# Altium schematic sheet digital.SchDoc: Digital
size A4; DrawnBy: ZXR; DocumentNumber: 20251214; Revision: 1.0; SheetNumber: 2; SheetTotal: 2
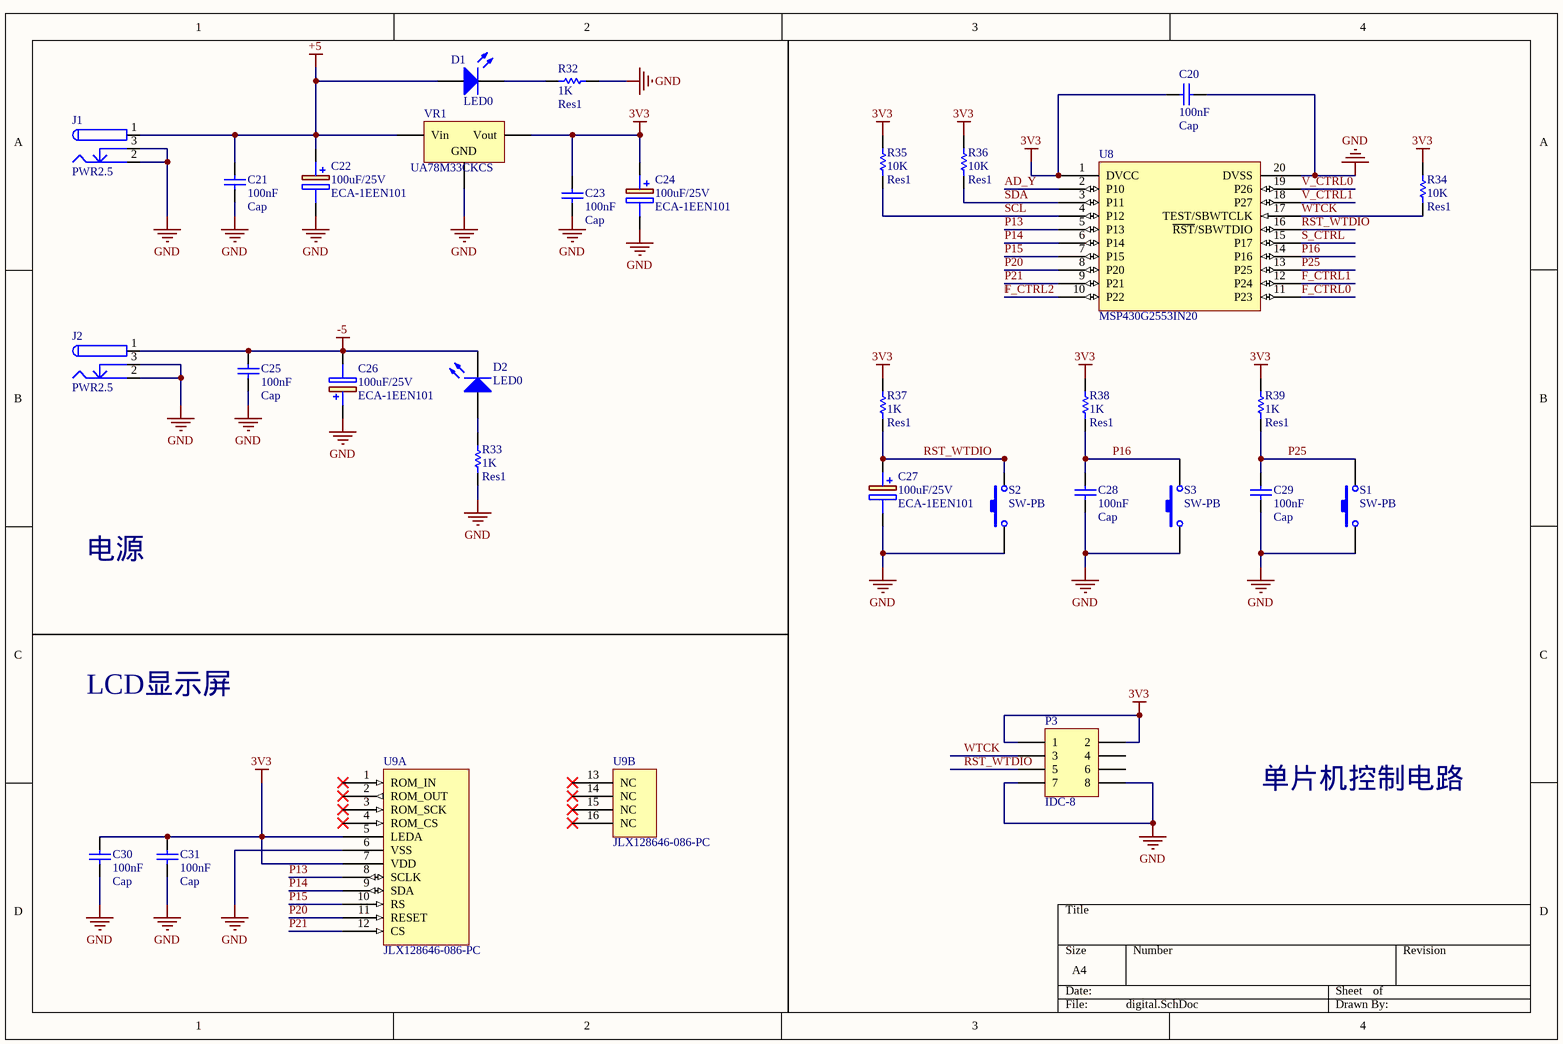
[diagram p0: digital.SchDoc]

## Parts
C20  Cap  value 100nF  [RAD-0.2-cap]
C21  Cap  value 100nF  [RAD-0.2-cap]
C22  ECA-1EEN101  value 100uF/25V  [CAPPRD350W65D800H1250]
C23  Cap  value 100nF  [RAD-0.2-cap]
C24  ECA-1EEN101  value 100uF/25V  [CAPPRD350W65D800H1250]
C25  Cap  value 100nF  [RAD-0.2-cap]
C26  ECA-1EEN101  value 100uF/25V  [CAPPRD350W65D800H1250]
C27  ECA-1EEN101  value 100uF/25V  [CAPPRD350W65D800H1250]
C28  Cap  value 100nF  [RAD-0.2-cap]
C29  Cap  value 100nF  [RAD-0.2-cap]
C30  Cap  value 100nF  [RAD-0.2-cap]
C31  Cap  value 100nF  [RAD-0.2-cap]
D1  LED0  [LED-GREEN]
D2  LED0  [LED-GREEN]
J1  PWR2.5  [KOBI-16PJ032_V]
J2  PWR2.5  [KOBI-16PJ032_V]
P3  IDC-8  [IDC-8]
R32  Res1  value 1K  [RES-AXIAL-0.4]
R33  Res1  value 1K  [RES-AXIAL-0.4]
R34  Res1  value 10K  [RES-AXIAL-0.4]
R35  Res1  value 10K  [RES-AXIAL-0.4]
R36  Res1  value 10K  [RES-AXIAL-0.4]
R37  Res1  value 1K  [RES-AXIAL-0.4]
R38  Res1  value 1K  [RES-AXIAL-0.4]
R39  Res1  value 1K  [RES-AXIAL-0.4]
S1  SW-PB  [FSM18JH]
S2  SW-PB  [FSM18JH]
S3  SW-PB  [FSM18JH]
U8  MSP430G2553IN20  [MSP430G2553IN20 - duplicate]
U9  JLX128646-086-PC  [JLX128646-086-PC]  (parts A,B of 2)
VR1  UA78M33CKCS  [TO254P470X1016X1965-3P]

## Nets
3V3: C20.1 C23.2 C24.1(+) C30.2 C31.1 P3.1 P3.2 R34.2 R35.2 R36.2 R37.2 R38.2 R39.2 U8.1(DVCC) U9.5(LEDA) U9.7(VDD) VR1.3(Vout)
+5: C21.2 C22.1(+) D1.1(A) J1.1 VR1.1(Vin)
-5: C25.2 C26.2(-) D2.2(K) J2.1
GND: C20.2 C21.1 C22.2(-) C23.1 C24.2(-) C25.1 C26.1(+) C27.2(-) C28.1 C29.1 C30.1 C31.2 J1.2 J1.3 J2.2 J2.3 P3.7 P3.8 R32.2 R33.1 S1.1 S2.1 S3.1 U8.20(DVSS) U9.6(VSS) VR1.2(GND)
: U8.10(P22)  [also labelled F_CTRL2]
AD_Y: U8.2(P10)
F_CTRL0: U8.11(P23)
F_CTRL1: U8.12(P24)
P13: U8.5(P13) U9.8(SCLK)
P14: U8.6(P14) U9.9(SDA)
P15: U8.7(P15) U9.10(RS)
P16: C28.2 R38.1 S3.2 U8.14(P16)
P20: U8.8(P20) U9.11(RESET)
P21: U8.9(P21) U9.12(CS)
P25: C29.2 R39.1 S1.2 U8.13(P25)
RST_WTDIO: C27.1(+) P3.5 R37.1 S2.2 U8.16(~{RST}/SBWTDIO)
S_CTRL: U8.15(P17)
SCL: R35.1 U8.4(P12)
SDA: R36.1 U8.3(P11)
V_CTRL0: U8.19(P26)
V_CTRL1: U8.18(P27)
WTCK: P3.3 R34.1 U8.17(TEST/SBWTCLK)
NetD1_2: D1.2(K) R32.1
NetD2_1: D2.1(A) R33.2

Not connected (* = marked no-connect by the designer): P3 4 6; U9 1(ROM_IN)* 2(ROM_OUT)* 3(ROM_SCK)* 4(ROM_CS)* 13(NC)* 14(NC)* 15(NC)* 16(NC)*

## Notes on the sheet
- 电源
- LCD显示屏
- 单片机控制电路

## Library data of the parts
C20 C21 C23 C25 C28-C31 = Cap: Capacitor; Published: 8-Jun-2000; LatestRevisionDate: 17-Jul-2002; LatestRevisionNote: Re-released for DXP Platform.; PackageReference: RAD-0.3; Publisher: Altium Limited; PackageDescription: Radial Cap, Thru-Hole; 2 Leads; 0.3 in Pin Spacing
C22 C24 C26 C27 = ECA-1EEN101: Capacitor Polarised; Manufacturer_Name: Panasonic; Datasheet Link: https://www.mouser.in/datasheet/2/315/ABA0000C1044-947503.pdf; Height: 12.5mm; Manufacturer_Part_Number: ECA-1EEN101; Mouser Part Number: 667-ECA-1EEN101; Mouser Price/Stock: https://www.mouser.co.uk/ProductDetail/Panasonic/ECA-1EEN101?qs=tfZGHB2PWd0NYnCl82fG3g%3D%3D
D1 D2 = LED0: Typical INFRARED GaAs LED; Published: 8-Jun-2000; LatestRevisionDate: 08-Jul-2005; LatestRevisionNote: Mech Layer 1 removed.; PackageReference: LED-0; Publisher: Altium Limited; PackageDescription: LED; 2 Leads
J1 J2 = PWR2.5: Low Voltage Power Supply Connector; Published: 17-Dec-2003; DatasheetDocument: 09-May-2002; Publisher: Altium Limited; ComponentLink1Description: Manufacturer Link; ComponentLink1URL: http://domino.kycon.com/internet/Products.html
P3 = IDC-8: Header, 4-Pin, Dual row; LatestRevisionDate: 17-Jul-2002; LatestRevisionNote: Re-released for DXP Platform.; Publisher: Altium Limited
R32-R39 = Res1: Resistor; Published: 8-Jun-2000; LatestRevisionDate: 17-Jul-2002; LatestRevisionNote: Re-released for DXP Platform.; PackageReference: AXIAL-0.3; Publisher: Altium Limited; PackageDescription: Axial Device, Thru-Hole; 2 Leads; 0.3 in Pin Spacing
S1-S3 = SW-PB: Switch; Published: 24-Mar-1999; LatestRevisionDate: 17-Jul-2002; LatestRevisionNote: Re-released for DXP Platform.; PackageReference: SPST-2; Publisher: Altium Limited; PackageDescription: Switch; 2 Leads
U8 = MSP430G2553: 混合处理器
U9 = JLX128646-086-PC: LCD 128*64
VR1 = UA78M33CKCS: Voltage Regulator; Published: 24-Mar-1999; LatestRevisionDate: 29-May-2009; LatestRevisionNote: IPC-7351 Footprint Added.; PackageReference: D2PAK; Publisher: Altium Limited; PackageDescription: 3-Pin Transistor Outline Package 2.54 mm Pitch, 15.1 mm Lead Span